# Altium schematic sheet EEM_CONN.SchDoc
size A3; SheetNumber: 5; SheetTotal: 7
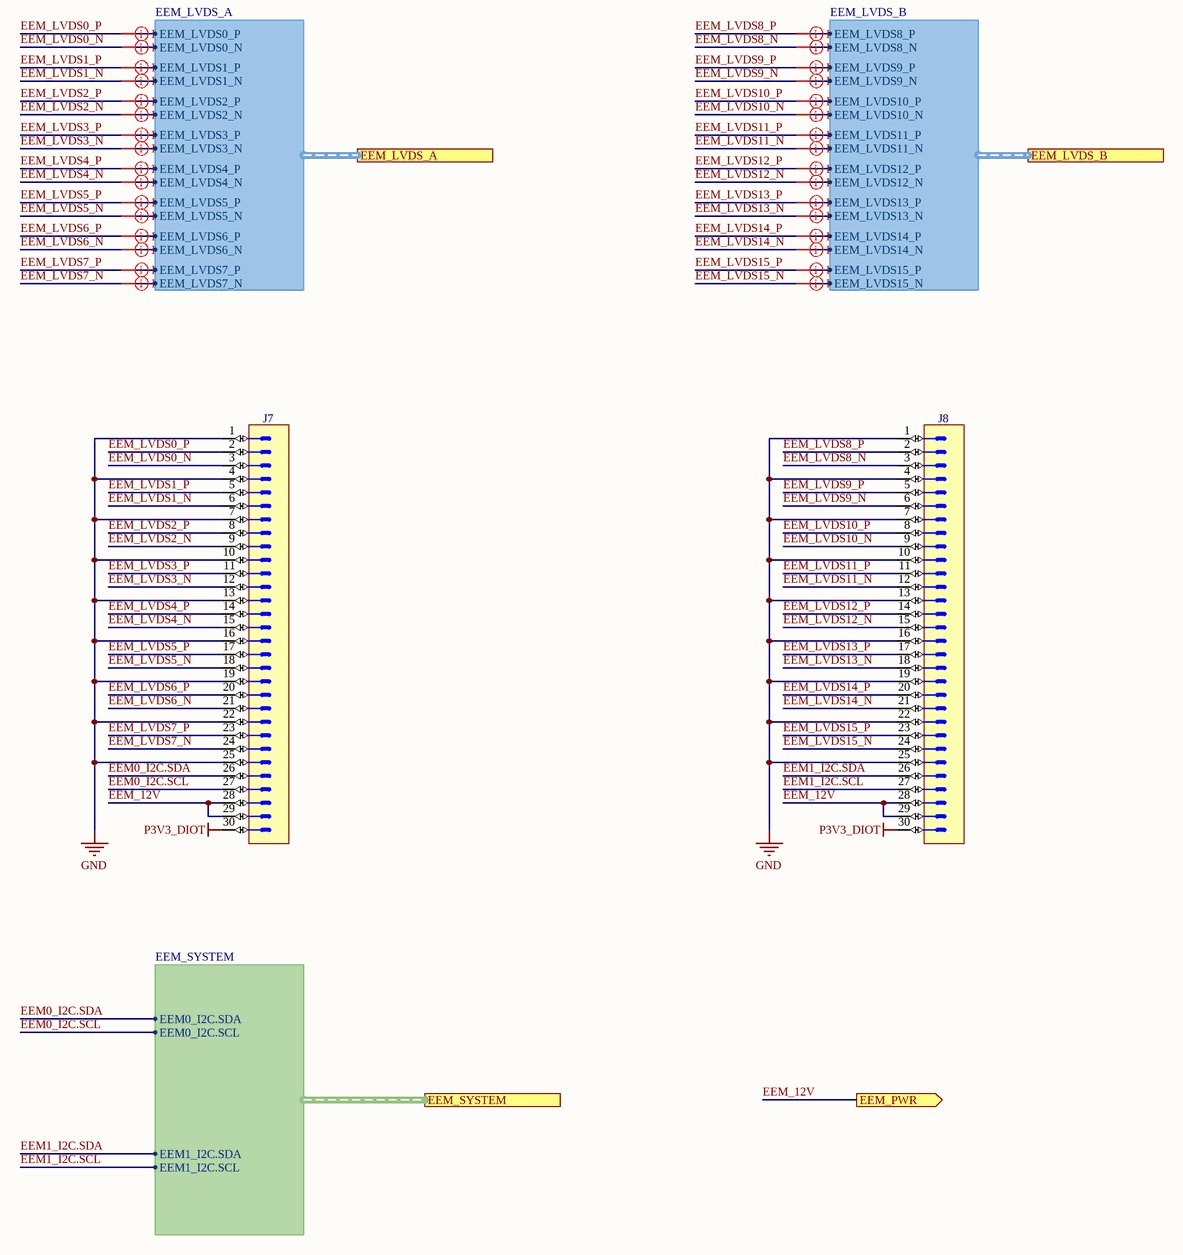
[diagram p0: EEM_CONN.SchDoc]

## Parts
J7  (no value)  [3M_N2530-6002RB]
J8  (no value)  [3M_N2530-6002RB]

## Ports
EEM_LVDS_A (harness EEM_LVDS_A, see BLOCK_DIAGRAM[6C], REDRIVERS[1C]), EEM_LVDS_B (harness EEM_LVDS_B, see BLOCK_DIAGRAM[6C], REDRIVERS[1D]), EEM_PWR (out, see BLOCK_DIAGRAM[6B], PSU[1A]), EEM_SYSTEM (harness EEM_SYSTEM, see BLOCK_DIAGRAM[7B], SYSTEM[1B])

## Harnesses
EEM_SYSTEM: EEM0_I2C.SDA, EEM0_I2C.SCL, EEM1_I2C.SDA, EEM1_I2C.SCL
EEM_LVDS_A: EEM_LVDS0_P, EEM_LVDS0_N, EEM_LVDS1_P, EEM_LVDS1_N, EEM_LVDS2_P, EEM_LVDS2_N, EEM_LVDS3_P, EEM_LVDS3_N, EEM_LVDS4_P, EEM_LVDS4_N, EEM_LVDS5_P, EEM_LVDS5_N, EEM_LVDS6_P, EEM_LVDS6_N, EEM_LVDS7_P, EEM_LVDS7_N
EEM_LVDS_B: EEM_LVDS8_P, EEM_LVDS8_N, EEM_LVDS9_P, EEM_LVDS9_N, EEM_LVDS10_P, EEM_LVDS10_N, EEM_LVDS11_P, EEM_LVDS11_N, EEM_LVDS12_P, EEM_LVDS12_N, EEM_LVDS13_P, EEM_LVDS13_N, EEM_LVDS14_P, EEM_LVDS14_N, EEM_LVDS15_P, EEM_LVDS15_N

## Nets
GND: J7.1 J7.4 J7.7 J7.10 J7.13 J7.16 J7.19 J7.22 J7.25 J8.1 J8.4 J8.7 J8.10 J8.13 J8.16 J8.19 J8.22 J8.25
P3V3_DIOT: J7.30 J8.30
EEM0_I2C.SCL: J7.27 ; port EEM_SYSTEM.EEM0_I2C.SCL
EEM0_I2C.SDA: J7.26 ; port EEM_SYSTEM.EEM0_I2C.SDA
EEM1_I2C.SCL: J8.27 ; port EEM_SYSTEM.EEM1_I2C.SCL
EEM1_I2C.SDA: J8.26 ; port EEM_SYSTEM.EEM1_I2C.SDA
EEM_12V: J7.28 J7.29 J8.28 J8.29 ; port EEM_PWR
EEM_LVDS0_N: J7.3 ; port EEM_LVDS_A.EEM_LVDS0_N
EEM_LVDS0_P: J7.2 ; port EEM_LVDS_A.EEM_LVDS0_P
EEM_LVDS1_N: J7.6 ; port EEM_LVDS_A.EEM_LVDS1_N
EEM_LVDS1_P: J7.5 ; port EEM_LVDS_A.EEM_LVDS1_P
EEM_LVDS2_N: J7.9 ; port EEM_LVDS_A.EEM_LVDS2_N
EEM_LVDS2_P: J7.8 ; port EEM_LVDS_A.EEM_LVDS2_P
EEM_LVDS3_N: J7.12 ; port EEM_LVDS_A.EEM_LVDS3_N
EEM_LVDS3_P: J7.11 ; port EEM_LVDS_A.EEM_LVDS3_P
EEM_LVDS4_N: J7.15 ; port EEM_LVDS_A.EEM_LVDS4_N
EEM_LVDS4_P: J7.14 ; port EEM_LVDS_A.EEM_LVDS4_P
EEM_LVDS5_N: J7.18 ; port EEM_LVDS_A.EEM_LVDS5_N
EEM_LVDS5_P: J7.17 ; port EEM_LVDS_A.EEM_LVDS5_P
EEM_LVDS6_N: J7.21 ; port EEM_LVDS_A.EEM_LVDS6_N
EEM_LVDS6_P: J7.20 ; port EEM_LVDS_A.EEM_LVDS6_P
EEM_LVDS7_N: J7.24 ; port EEM_LVDS_A.EEM_LVDS7_N
EEM_LVDS7_P: J7.23 ; port EEM_LVDS_A.EEM_LVDS7_P
EEM_LVDS8_N: J8.3 ; port EEM_LVDS_B.EEM_LVDS8_N
EEM_LVDS8_P: J8.2 ; port EEM_LVDS_B.EEM_LVDS8_P
EEM_LVDS9_N: J8.6 ; port EEM_LVDS_B.EEM_LVDS9_N
EEM_LVDS9_P: J8.5 ; port EEM_LVDS_B.EEM_LVDS9_P
EEM_LVDS10_N: J8.9 ; port EEM_LVDS_B.EEM_LVDS10_N
EEM_LVDS10_P: J8.8 ; port EEM_LVDS_B.EEM_LVDS10_P
EEM_LVDS11_N: J8.12 ; port EEM_LVDS_B.EEM_LVDS11_N
EEM_LVDS11_P: J8.11 ; port EEM_LVDS_B.EEM_LVDS11_P
EEM_LVDS12_N: J8.15 ; port EEM_LVDS_B.EEM_LVDS12_N
EEM_LVDS12_P: J8.14 ; port EEM_LVDS_B.EEM_LVDS12_P
EEM_LVDS13_N: J8.18 ; port EEM_LVDS_B.EEM_LVDS13_N
EEM_LVDS13_P: J8.17 ; port EEM_LVDS_B.EEM_LVDS13_P
EEM_LVDS14_N: J8.21 ; port EEM_LVDS_B.EEM_LVDS14_N
EEM_LVDS14_P: J8.20 ; port EEM_LVDS_B.EEM_LVDS14_P
EEM_LVDS15_N: J8.24 ; port EEM_LVDS_B.EEM_LVDS15_N
EEM_LVDS15_P: J8.23 ; port EEM_LVDS_B.EEM_LVDS15_P

## Layout directives
differential pair; net class LVDS; differential pair class LVDS_DIFF: EEM_LVDS0_N, EEM_LVDS0_P, EEM_LVDS1_N, EEM_LVDS1_P, EEM_LVDS2_N, EEM_LVDS2_P, EEM_LVDS3_N, EEM_LVDS3_P, EEM_LVDS4_N, EEM_LVDS4_P, EEM_LVDS5_N, EEM_LVDS5_P, EEM_LVDS6_N, EEM_LVDS6_P, EEM_LVDS7_N, EEM_LVDS7_P, EEM_LVDS8_N, EEM_LVDS8_P, EEM_LVDS9_N, EEM_LVDS9_P, EEM_LVDS10_N, EEM_LVDS10_P, EEM_LVDS11_N, EEM_LVDS11_P, EEM_LVDS12_N, EEM_LVDS12_P, EEM_LVDS13_N, EEM_LVDS13_P, EEM_LVDS14_N, EEM_LVDS14_P, EEM_LVDS15_N, EEM_LVDS15_P

## Library data of the parts
J7 J8 = 3M_N2530-6002RB: Connector 30 Male; Part Description: 30 Contacts - Straight .100'' x .100'' Low Profile Four-Wall Header, 2500 Series; Manufacturer: 3M; PressFit: No; Part Number: 3M_N2530-6002RB; Component Kind: Standard; Component Type: Standard; Pin Count: 30; Family: Header 30; Mounted: Yes; Socket: No; SMD: No; Sense: No; Status: None; Manufacturer Part Number: N2530-6002RB; ComponentHeight: 10.03mm; HelpURL: \\cern.ch\dfs\Applications\Altium\Datasheets\3M_N2530-6002RB.pdf; Author: CERN DEM JLC; CreateDate: 11.02.2009; LatestRevisionDate: 11.08.2009